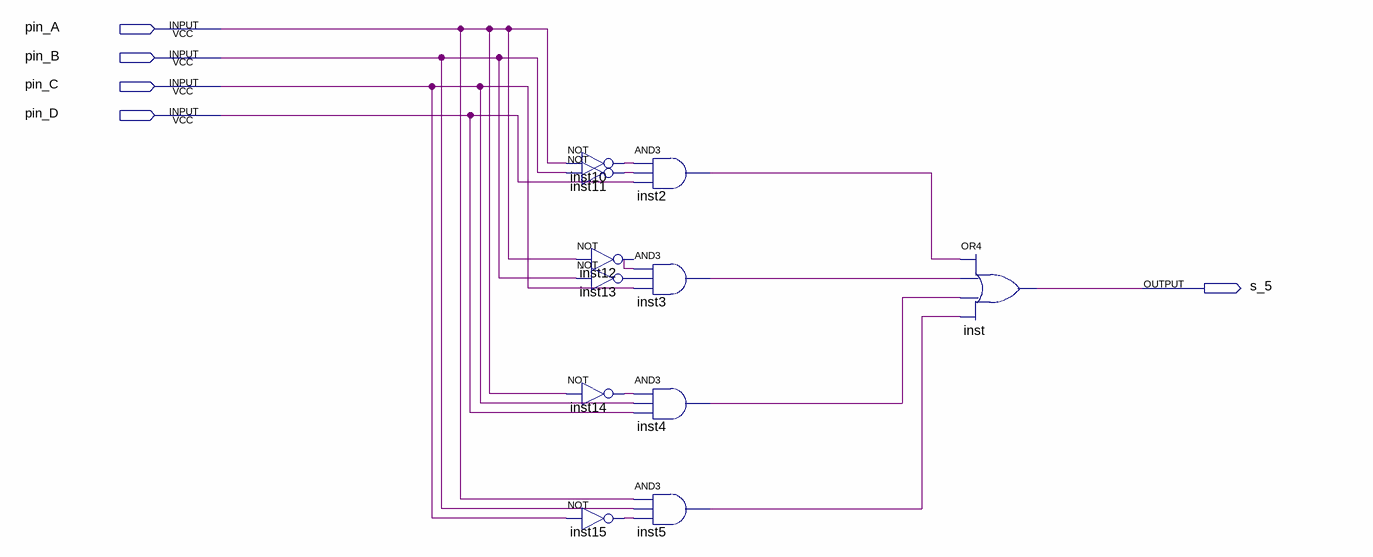
[diagram p0: schematic sheet]
// Quartus schematic s_5 - Copy.bdf as structural Verilog: 11 symbols, 5 pins
module \s_5_-_Copy  (
  input  pin_A,
  input  pin_B,
  input  pin_C,
  input  pin_D,
  output s_5
);

  wire inst2_out, inst3_out, inst4_out, inst5_out, inst10_out, inst11_out, inst12_out, inst13_out,
       inst14_out, inst15_out;

  not inst10 (inst10_out, pin_A);
  not inst11 (inst11_out, pin_B);
  not inst12 (inst12_out, pin_A);
  not inst13 (inst13_out, pin_B);
  not inst14 (inst14_out, pin_A);
  not inst15 (inst15_out, pin_C);
  and inst2 (inst2_out, inst10_out, inst11_out, pin_D);
  and inst3 (inst3_out, inst12_out, inst13_out, pin_C);
  and inst4 (inst4_out, inst14_out, pin_C, pin_D);
  and inst5 (inst5_out, pin_A, pin_B, inst15_out);
  or inst (s_5, inst2_out, inst3_out, inst4_out, inst5_out);
endmodule
